# Altium schematic sheet SAO_Area3001_S_TOP_00.SchDoc: SAO.69 AREA 3001 Small
size A3; Date: 24/06/2019; DrawnBy: Wim Van Gool; DocumentNumber: 1; Revision: 00; SheetNumber: 1; SheetTotal: 1
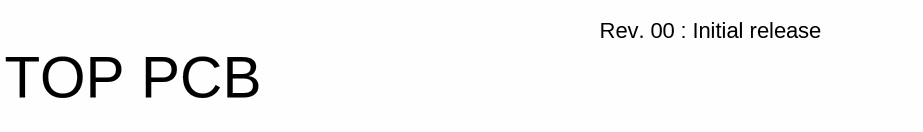
[diagram p0: SAO_Area3001_S_TOP_00.SchDoc]

## Notes on the sheet
- Rev. 00 : Initial release
- TOP PCB
- Title
- Revision
- Date
- Dranw By
- Size
- A3
- Sheet
- of